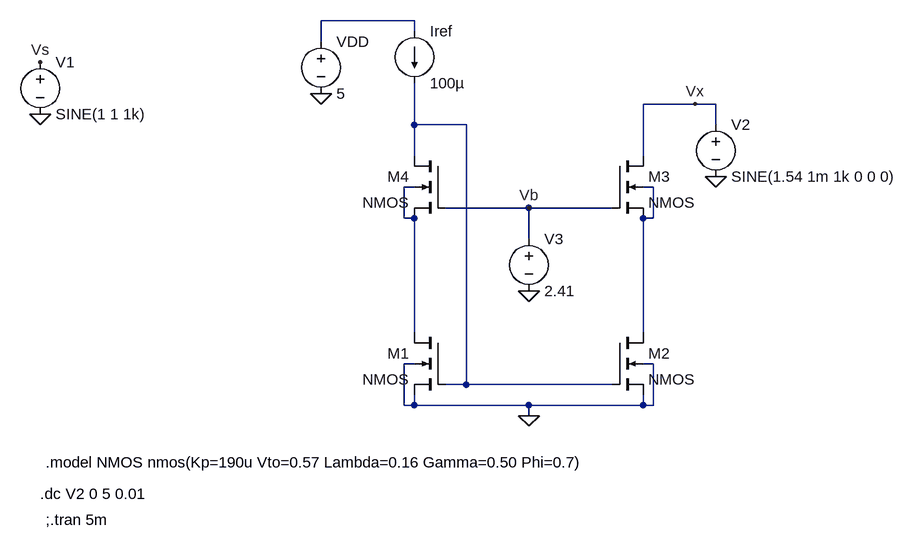
[diagram p0: schematic Low_voltage_CCS.asc]
Low_voltage_CCS.asc, the LTspice schematic file:
Version 4
SHEET 1 1072 680
WIRE 96 -320 -48 -320
WIRE 96 -304 96 -320
WIRE -48 -288 -48 -320
WIRE 528 -192 448 -192
WIRE 560 -192 528 -192
WIRE 96 -160 96 -224
WIRE 176 -160 96 -160
WIRE 560 -160 560 -192
WIRE 96 -112 96 -160
WIRE 448 -112 448 -192
WIRE 96 -64 80 -64
WIRE 464 -64 448 -64
WIRE 272 -32 144 -32
WIRE 400 -32 272 -32
WIRE 80 -16 80 -64
WIRE 96 -16 80 -16
WIRE 464 -16 464 -64
WIRE 464 -16 448 -16
WIRE 272 16 272 -32
WIRE 96 160 96 -16
WIRE 448 160 448 -16
WIRE 96 208 80 208
WIRE 464 208 448 208
WIRE 176 240 176 -160
WIRE 176 240 144 240
WIRE 400 240 176 240
WIRE 80 272 80 208
WIRE 96 272 96 256
WIRE 96 272 80 272
WIRE 272 272 96 272
WIRE 448 272 448 256
WIRE 448 272 272 272
WIRE 464 272 464 208
WIRE 464 272 448 272
WIRE 272 288 272 272
FLAG -48 -208 0
FLAG 272 96 0
FLAG 560 -80 0
FLAG 272 288 0
FLAG 272 -32 Vb
FLAG 528 -192 Vx
FLAG -480 -176 0
FLAG -480 -256 Vs
SYMBOL nmos4 144 160 M0
SYMATTR InstName M1
SYMBOL nmos4 400 160 R0
SYMATTR InstName M2
SYMBOL nmos4 400 -112 R0
SYMATTR InstName M3
SYMBOL nmos4 144 -112 M0
SYMATTR InstName M4
SYMBOL voltage -48 -304 R0
SYMATTR InstName VDD
SYMATTR Value 5
SYMBOL voltage 560 -176 R0
WINDOW 123 0 0 Left 0
WINDOW 39 0 0 Left 0
SYMATTR InstName V2
SYMATTR Value SINE(1.54 1m 1k 0 0 0)
SYMBOL voltage 272 0 R0
WINDOW 123 0 0 Left 0
WINDOW 39 0 0 Left 0
SYMATTR InstName V3
SYMATTR Value 2.41
SYMBOL current 96 -304 R0
SYMATTR InstName Iref
SYMATTR Value 100µ
SYMBOL voltage -480 -272 R0
WINDOW 123 0 0 Left 0
WINDOW 39 0 0 Left 0
SYMATTR InstName V1
SYMATTR Value SINE(1 1 1k)
TEXT -480 408 Left 2 !.dc V2 0 5 0.01
TEXT -472 360 Left 2 !.model NMOS nmos(Kp=190u Vto=0.57 Lambda=0.16 Gamma=0.50 Phi=0.7)
TEXT -472 448 Left 2 !;.tran 5m

The netlist it stands for:
* Low_voltage_CCS.asc
M1 N003 N002 0 0 NMOS
M2 N004 N002 0 0 NMOS
M3 Vx Vb N004 N004 NMOS
M4 N002 Vb N003 N003 NMOS
VDD N001 0 5
V2 Vx 0 SINE(1.54 1m 1k 0 0 0)
V3 Vb 0 2.41
Iref N001 N002 100µ
V1 Vs 0 SINE(1 1 1k)
.model NMOS NMOS
.model PMOS PMOS
.lib standard.mos
.dc V2 0 5 0.01
.model NMOS nmos(Kp=190u Vto=0.57 Lambda=0.16 Gamma=0.50 Phi=0.7)
;.tran 5m
.backanno
.end